# EAGLE design MOD-Z_01_V02 (EAGLE 9.6.2)
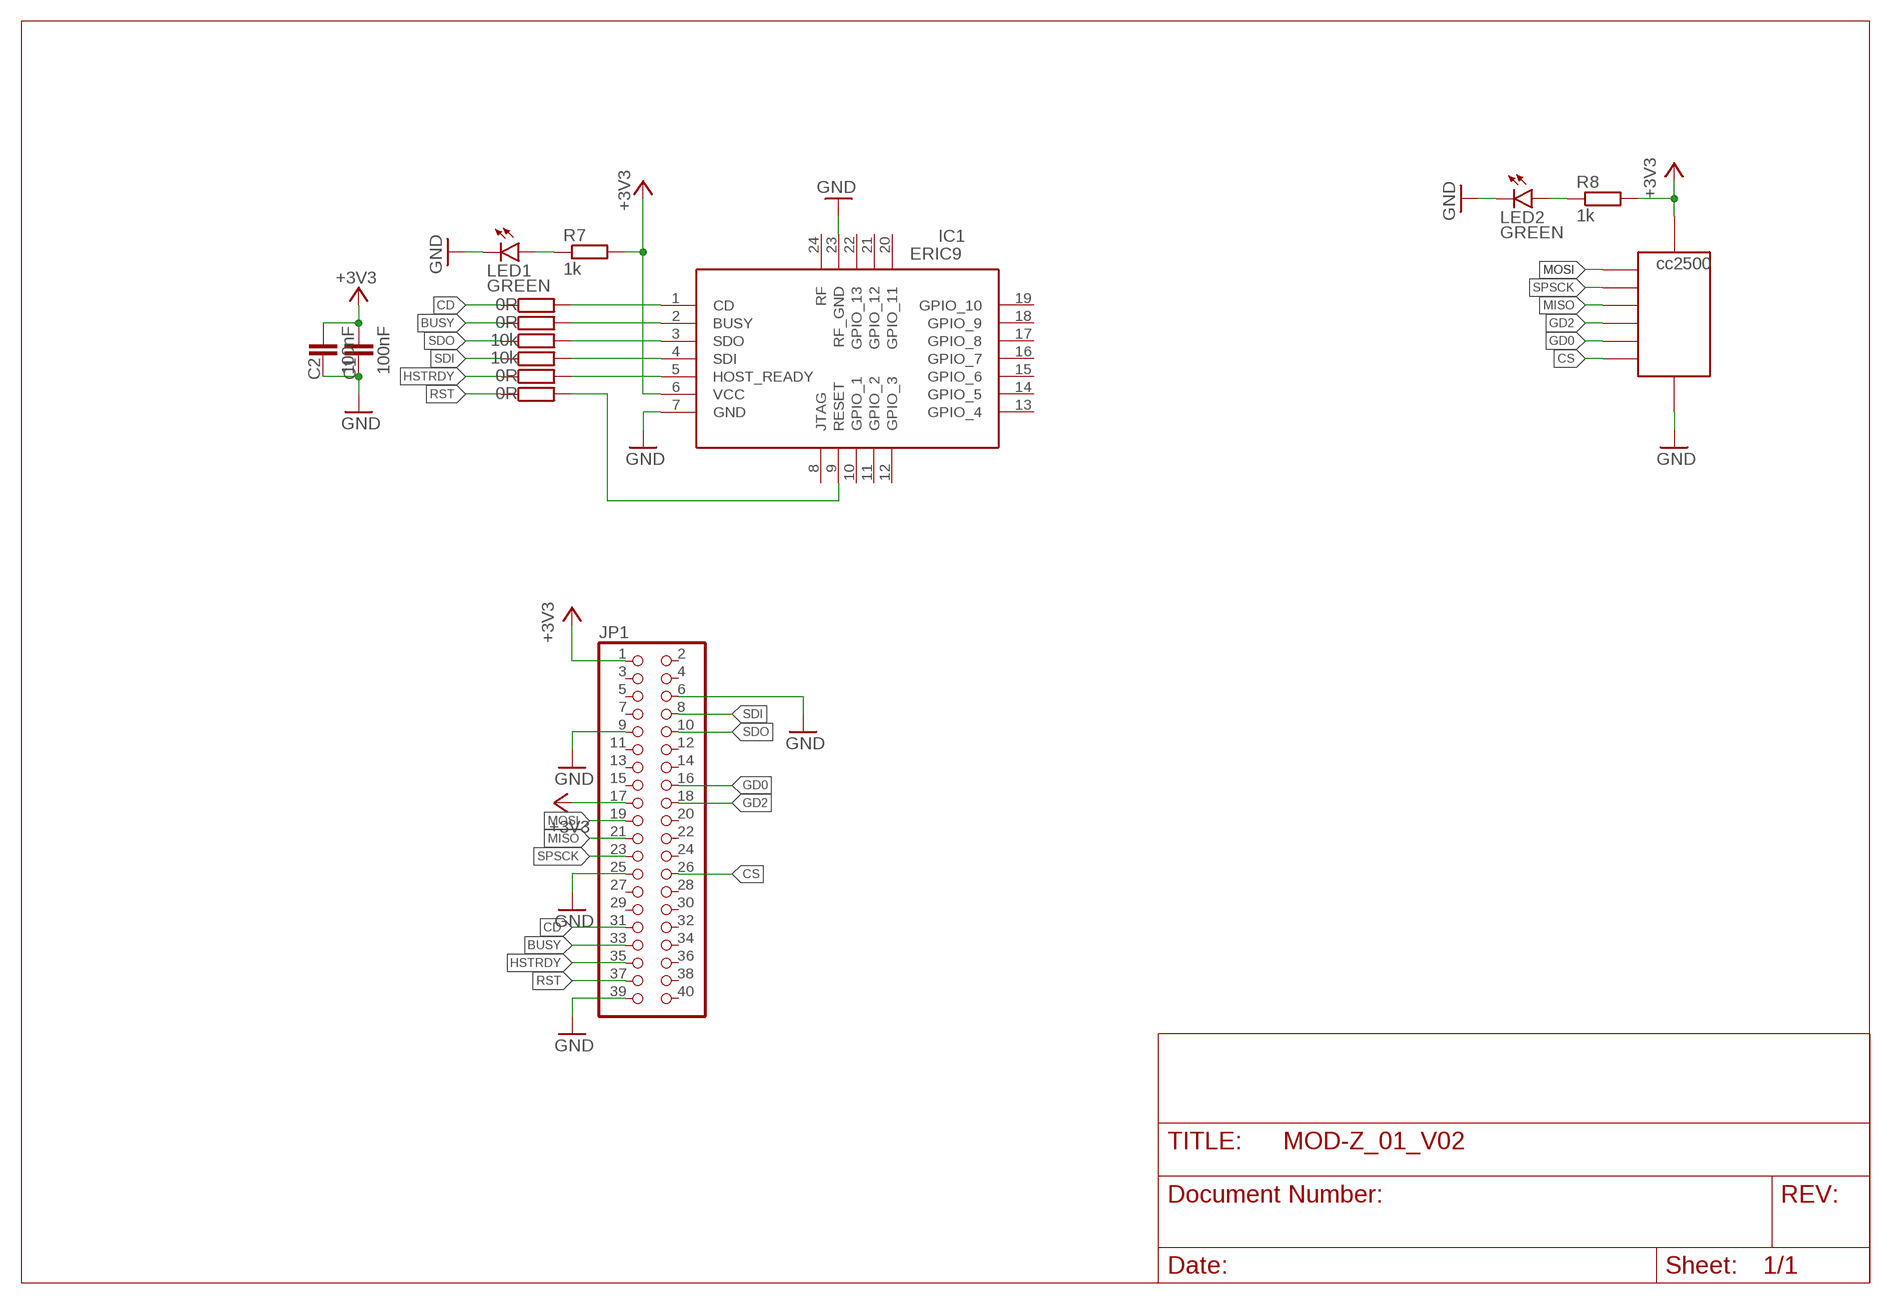
[diagram p0: schematic, sheet 1]

## Parts
C1  100nF  C-EUC0805  [C0805]
C2  100nF  C-EUC0805  [C0805]
IC1  ERIC9  [ERIC9]
IC2  CC2500  [CC2500]
JP1  PINHD-2X20  [2X20]
LED1  GREEN  LEDCHIP-LED0805  [CHIP-LED0805]
LED2  GREEN  LEDCHIP-LED0805  [CHIP-LED0805]
R1  0R  R-EU_R0805  [R0805]
R2  0R  R-EU_R0805  [R0805]
R3  10k  R-EU_R0805  [R0805]
R4  10k  R-EU_R0805  [R0805]
R5  0R  R-EU_R0805  [R0805]
R6  0R  R-EU_R0805  [R0805]
R7  1k  R-EU_R0805  [R0805]
R8  1k  R-EU_R0805  [R0805]

## Nets
+3V3: C1.1 C2.1 IC1.6(VCC) IC2.+3V3 JP1.1 JP1.17 R7.2 R8.2
BUSY: JP1.33 R2.1
CD: JP1.31 R1.1
CS: IC2.CS JP1.26
GD0: IC2.SPSCK JP1.16
GD2: IC2.MOSI JP1.18
GND: C1.2 C2.2 IC1.7(GND) IC1.23(RF_GND) IC2.GND JP1.6 JP1.9 JP1.25 JP1.39 LED1.C LED2.C
HSTRDY: JP1.35 R5.1
MISO: IC2.MISO JP1.21
MOSI: IC2.GD0 JP1.19
N$1: LED2.A R8.1
N$2: IC1.1(CD) R1.2
N$4: IC1.9(RESET) R6.2
N$5: IC1.2(BUSY) R2.2
N$6: IC1.3(SDO) R3.2
N$7: IC1.4(SDI) R4.2
N$8: IC1.5(HOST_READY) R5.2
N$19: LED1.A R7.1
RST: JP1.37 R6.1
SDI: JP1.8 R4.1
SDO: JP1.10 R3.1
SPSCK: IC2.GD2 JP1.23
Unconnected: IC1.8(JTAG) IC1.10(GPIO_1) IC1.11(GPIO_2) IC1.12(GPIO_3) IC1.13(GPIO_4) IC1.14(GPIO_5) IC1.15(GPIO_6) IC1.16(GPIO_7) IC1.17(GPIO_8) IC1.18(GPIO_9) IC1.19(GPIO_10) IC1.20(GPIO_11) IC1.21(GPIO_12) IC1.22(GPIO_13) IC1.24(RF) JP1.2 JP1.3 JP1.4 JP1.5 JP1.7 JP1.11 JP1.12 JP1.13 JP1.14 JP1.15 JP1.20 JP1.22 JP1.24 JP1.27 JP1.28 JP1.29 JP1.30 JP1.32 JP1.34 JP1.36 JP1.38 JP1.40

## Library data of the parts
C1 C2 = rcl:C-EU: CAPACITOR, European symbol; SPICEPREFIX: C
IC1 = eRIC9:ERIC9: eRIC9 Radio Transceiver !! Source: Datasheet <https://www.mouser.com/datasheet/2/743/lprs_eRIC9-FCC-1217491.pdf>; DESCRIPTION: eRIC9 Radio Transceiver !!; HEIGHT: 2mm; MANUFACTURER_NAME: LPRS; MANUFACTURER_PART_NUMBER: eRIC9
IC2 = Andreas:CC2500
JP1 = pinhead:PINHD-2X20: PIN HEADER
LED1 LED2 = led:LED: LED OSRAM: - CHIPLED LG R971, LG N971, LY N971, LG Q971, LY Q971, LO R971, LY R971 LH N974, LH R974 LS Q976, LO Q976, LY Q976 LO Q996 - Hyper CHIPLED LW Q18S LB Q993, LB Q99A, LB R99A - SideLED LS A670, LO A670, LY A670, LG A670, LP A670 LB A673, LV A673, LT A673, LW A673 LH A674 LY A675 LS A676, LA A676, LO A676, LY A676, LW A676 LS A679, LY A679, LG A679 - Hyper Micro SIDELED® LS Y876, LA Y876, LO Y876, LY Y876 LT Y87S - SmartLED LW L88C, LW L88S LB L89C, LB L89S, LG L890 LS L89K, LO L89K, LY L89K LS L896, LA L896, LO L896, LY L896 - TOPLED LS T670, LO T670, LY T670, LG T670, LP T670 LSG T670, LSP T670, LSY T670, LOP T670, LYG T670 LG T671, LOG T671, LSG T671 LB T673, LV T673, LT T673, LW T673 LH T674 LS T676, LA T676, LO T676, LY T676, LB T676, LH T676, LSB T676, LW T676 LB T67C, LV T67C, LT T67C, LS T67K, LO T67K, LY T67K, LW E67C LS E67B, LA E67B, LO E67B, LY E67B, LB E67C, LV E67C, LT E67C LW T67C LS T679, LY T679, LG T679 LS T770, LO T770, LY T770, LG T770, LP T770 LB T773, LV T773, LT T773, LW T773 LH T774 LS E675, LA E675, LY E675, LS T675 LS T776, LA T776, LO T776, LY T776, LB T776 LHGB T686 LT T68C, LB T68C - Hyper Mini TOPLED® LB M676 - Mini TOPLED Santana® LG M470 LS M47K, LO M47K, LY M47K Source: http://www.osram.convergy.de LUXEON: - LUMILED® LXK2-PW12-R00, LXK2-PW12-S00, LXK2-PW14-U00, LXK2-PW14-V00 LXK2-PM12-R00, LXK2-PM12-S00, LXK2-PM14-U00 LXK2-PE12-Q00, LXK2-PE12-R00, LXK2-PE12-S00, LXK2-PE14-T00, LXK2-PE14-U00 LXK2-PB12-K00, LXK2-PB12-L00, LXK2-PB12-M00, LXK2-PB14-N00, LXK2-PB14-P00, LXK2-PB14-Q00 LXK2-PR12-L00, LXK2-PR12-M00, LXK2-PR14-Q00, LXK2-PR14-R00 LXK2-PD12-Q00, LXK2-PD12-R00, LXK2-PD12-S00 LXK2-PH12-R00, LXK2-PH12-S00 LXK2-PL12-P00, LXK2-PL12-Q00, LXK2-PL12-R00 Source: www.luxeon.com KINGBRIGHT: KA-3528ASYC Source: www.kingbright.com
R1-R8 = rcl:R-EU_: RESISTOR, European symbol; SPICEPREFIX: R

## Board
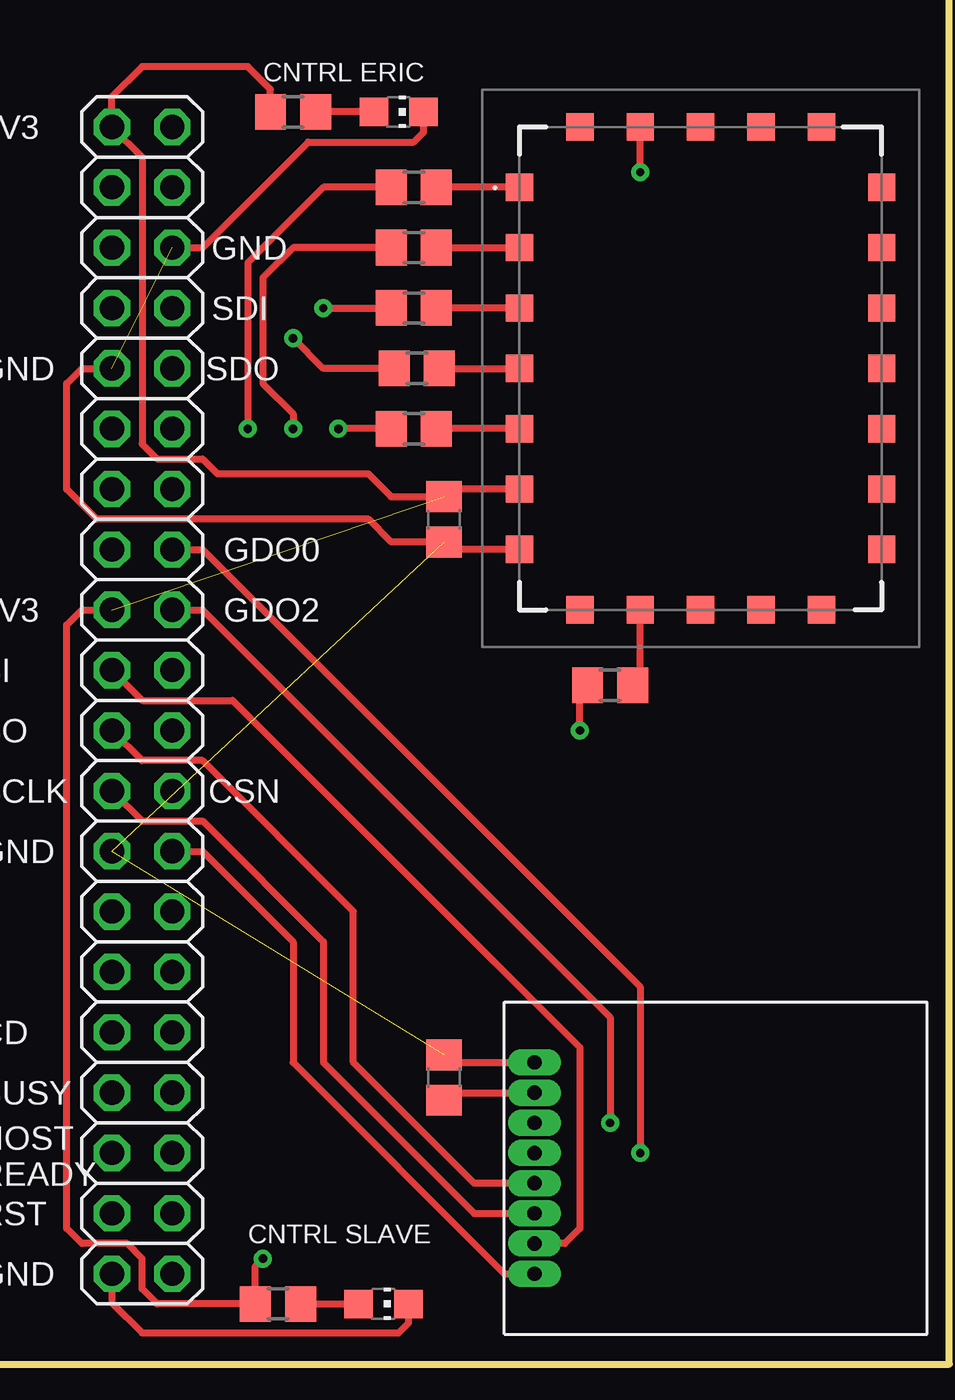
[diagram p1: board, top side]
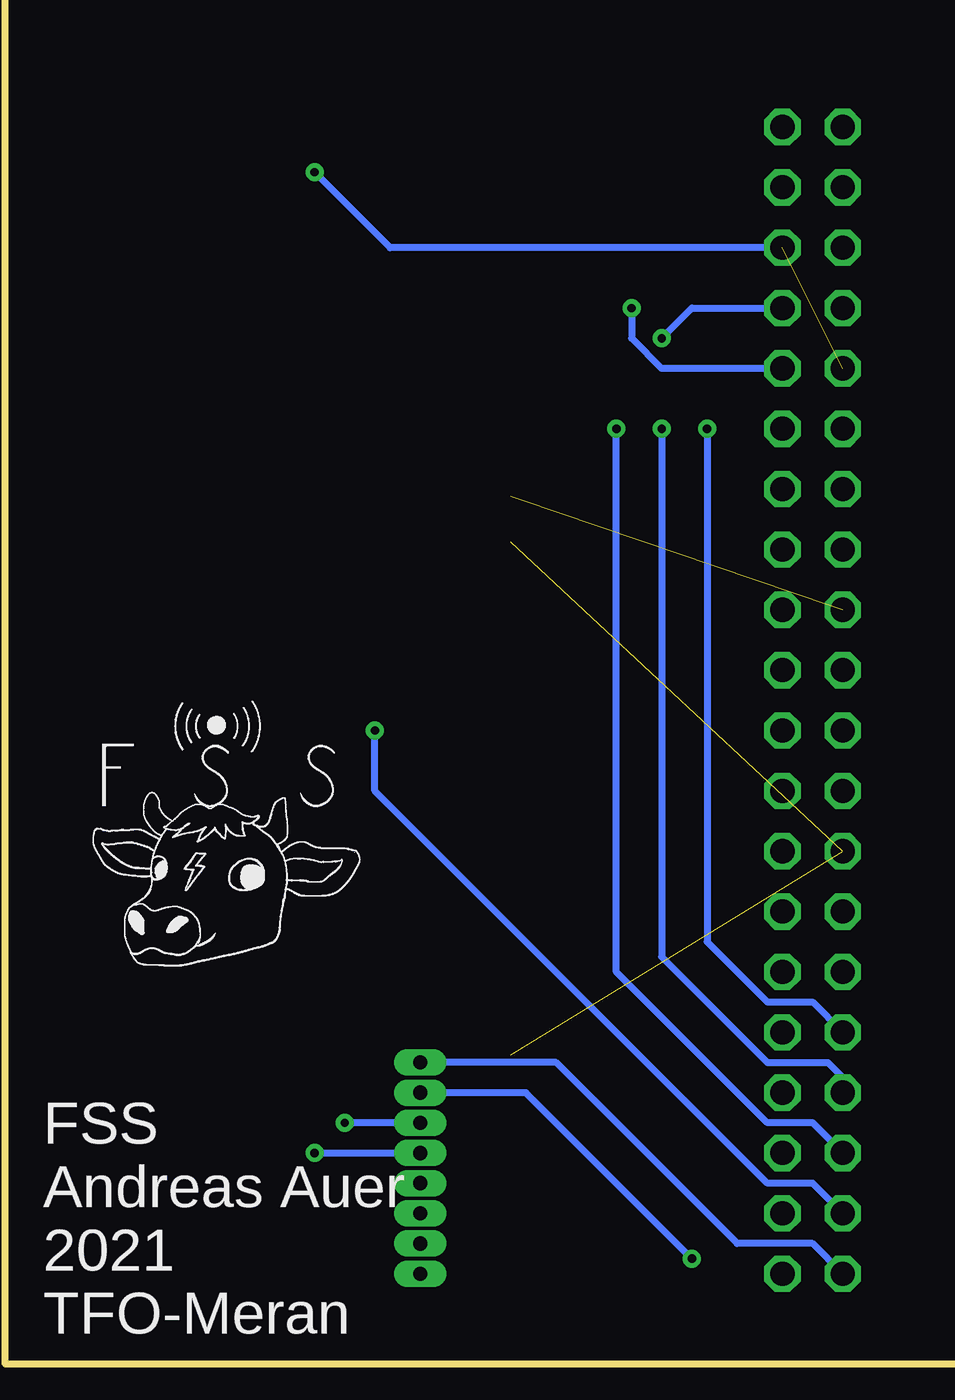
[diagram p2: board, bottom side, seen from below]

No outline drawn. Coordinates in mm, seen from the top.
Copper layers (1*16): Top 0.035mm / dielectric 1.5mm / Bottom 0.035mm
Design rules "default *": minimum track width 6mil, minimum drill 0.35mm, track to track 12mil, track to pad 12mil, pad to pad 12mil, via to via 12mil, smd to smd 12mil, copper to edge 40mil, drill to drill 12mil, minimum pad ring 10mil, minimum via ring 8mil, stop-mask expansion 4mil, vias tented up to drill 0mil, thermal gap 10mil
Milling: 4 lines

### Footprints (pad centres in the part's own frame; a part is rotated, then mirrored left to right if it is on the bottom)
C0805 = smd 1.3 x 1.5: 1 -0.95,0; 2 0.95,0
ERIC9 = smd 1.15 x 1.15: 1 -7.62,-7.62; 2 -5.08,-7.62; 3 -2.54,-7.62; 4 0,-7.62; 5 2.54,-7.62; 6 5.08,-7.62; 7 7.62,-7.62; 8 10.16,-5.08; 9 10.16,-2.54; 10 10.16,0; 11 10.16,2.54; 12 10.16,5.08; 13 7.62,7.62; 14 5.08,7.62; 15 2.54,7.62; 16 0,7.62; 17 -2.54,7.62; 18 -5.08,7.62; 19 -7.62,7.62; 20 -10.16,5.08; 21 -10.16,2.54; 22 -10.16,0; 23 -10.16,-2.54; 24 -10.16,-5.08
CC2500 = drill 0.6 pad 1.016 long: +3V3 1.27,8.89; CS 1.27,1.27; GD0 1.27,2.54; GD2 1.27,3.81; GND 1.27,10.16; MISO 1.27,5.08; MOSI 1.27,7.62; SPSCK 1.27,6.35
2X20 = drill 1.016 octagon: 1 -24.13,-1.27; 2 -24.13,1.27; 3 -21.59,-1.27; 4 -21.59,1.27; 5 -19.05,-1.27; 6 -19.05,1.27; 7 -16.51,-1.27; 8 -16.51,1.27; 9 -13.97,-1.27; 10 -13.97,1.27; 11 -11.43,-1.27; 12 -11.43,1.27; 13 -8.89,-1.27; 14 -8.89,1.27; 15 -6.35,-1.27; 16 -6.35,1.27; 17 -3.81,-1.27; 18 -3.81,1.27; 19 -1.27,-1.27; 20 -1.27,1.27; 21 1.27,-1.27; 22 1.27,1.27; 23 3.81,-1.27; 24 3.81,1.27; 25 6.35,-1.27; 26 6.35,1.27; 27 8.89,-1.27; 28 8.89,1.27; 29 11.43,-1.27; 30 11.43,1.27; 31 13.97,-1.27; 32 13.97,1.27; 33 16.51,-1.27; 34 16.51,1.27; 35 19.05,-1.27; 36 19.05,1.27; 37 21.59,-1.27; 38 21.59,1.27; 39 24.13,-1.27; 40 24.13,1.27
CHIP-LED0805 = smd 1.2 x 1.2: A 0,-1.05; C 0,1.05
R0805 = smd 1.3 x 1.5: 1 -0.95,0; 2 0.95,0

### Placement (x,y rotation side)
C1  18.41,35.56 270 top
C2  18.41,12.06 90 top
IC1  29.21,41.91 270 top
IC2  20.95,2.54 0 top
JP1  5.71,27.94 270 top
LED1  16.51,52.7 270 top
LED2  15.88,2.54 270 top
R1  17.14,49.53 0 top
R2  17.14,46.99 0 top
R3  17.14,44.45 0 top
R4  17.27,41.91 0 top
R5  17.14,39.37 0 top
R6  25.4,28.57 0 top
R7  12.06,52.7 180 top
R8  11.43,2.54 180 top

### Tracks (layer width: path | path; a pad name or v marks a point on that pad's centre or on a via)
+3V3  (via drill 0.35)  (1 unrouted)
  Top 0.305: IC1.6 18.73,36.83 C1.1 16.2,36.51 15.24,37.47 8.89,37.47 8.26,38.1 6.35,38.1 5.71,38.73 5.71,50.8 JP1.1 4.45,53.34 5.71,54.61 10.16,54.61 11.12,53.66 R7.2 | IC2.+3V3 18.73,11.43 C2.1 18.09,10.79 | JP1.17 3.17,31.75 2.54,31.11 2.54,5.71 3.17,5.08 5.08,5.08 5.71,4.45 5.71,3.17 6.35,2.54 R8.2 10.48,4.13 v10.79,4.45
  Bottom 0.305: v10.79,4.45 17.78,11.43 IC2.+3V3
BUSY  (via drill 0.35)
  Top 0.305: R2.1 12.06,46.99 10.79,45.72 10.79,41.27 12.06,40.01 v12.06,39.37
  Bottom 0.305: v12.06,39.37 12.06,17.14 7.62,12.7 5.08,12.7 4.45,12.06 JP1.33
CD  (via drill 0.35)
  Top 0.305: R1.1 13.34,49.53 10.16,46.35 v10.16,39.37
  Bottom 0.305: JP1.31 5.71,15.24 7.62,15.24 10.16,17.78 v10.16,39.37
CS
  Top 0.305: JP1.26 8.26,21.59 12.06,17.78 12.06,12.7 20.95,3.81 IC2.CS
GD0  (via drill 0.35)
  Top 0.305: JP1.16 8.26,34.29 26.67,15.88 v26.67,8.89
  Bottom 0.305: v26.67,8.89 IC2.SPSCK
GD2  (via drill 0.35)
  Top 0.305: JP1.18 8.26,31.75 25.4,14.61 v25.4,10.16
  Bottom 0.305: IC2.MOSI v25.4,10.16
GND  (via drill 0.35)  (3 unrouted)
  Top 0.305: IC1.7 18.73,34.29 C1.2 16.19,34.61 15.24,35.56 3.81,35.56 2.54,36.83 2.54,41.27 3.17,41.91 JP1.9 | v26.67,50.16 IC1.23 | JP1.6 8.26,46.99 12.7,51.44 17.14,51.44 17.56,51.85 LED1.C | C2.2 18.73,12.7 IC2.GND | JP1.39 4.45,2.59 5.71,1.32 16.51,1.32 16.93,1.74 LED2.C
  Bottom 0.305: JP1.6 23.5,46.99 v26.67,50.16 | JP1.39 5.71,5.08 8.89,5.08 16.51,12.7 IC2.GND
HSTRDY  (via drill 0.35)
  Top 0.305: R5.1 v13.97,39.37
  Bottom 0.305: JP1.35 5.71,10.16 7.62,10.16 13.97,16.51 v13.97,39.37
MISO
  Top 0.305: JP1.21 5.71,25.4 8.26,25.4 14.61,19.05 14.61,12.7 19.68,7.62 IC2.MISO
MOSI
  Top 0.305: JP1.19 5.71,27.94 9.53,27.94 24.13,13.34 24.13,5.71 23.5,5.08 IC2.GD0
N$1
  Top 0.305: R8.1 LED2.A
N$2
  Top 0.305: IC1.1 R1.2
N$4
  Top 0.305: R6.2 26.67,28.89 IC1.9
N$5
  Top 0.305: R2.2 IC1.2
N$6
  Top 0.305: IC1.3 R3.2
N$7
  Top 0.305: R4.2 IC1.4
N$8
  Top 0.305: IC1.5 R5.2
N$19
  Top 0.305: LED1.A R7.1
RST  (via drill 0.35)
  Top 0.305: v24.13,26.67 24.13,28.25 R6.1
  Bottom 0.305: v24.13,26.67 24.13,24.13 7.62,7.62 5.71,7.62 JP1.37
SDI  (via drill 0.35)
  Top 0.305: R4.1 13.34,41.91 v12.06,43.18
  Bottom 0.305: v12.06,43.18 10.79,44.45 JP1.8
SDO  (via drill 0.35)
  Top 0.305: v13.34,44.45 R3.1
  Bottom 0.305: JP1.10 12.06,41.91 13.34,43.18 v13.34,44.45
SPSCK
  Top 0.305: JP1.23 5.71,22.86 8.26,22.86 13.34,17.78 13.34,12.7 19.68,6.35 IC2.GD2

### Text on the board
tPlace: CNTRL ERIC | 3V3 | GND | SDI | GND | SDO | GDO0 | 3V3 | GDO2 | SI | SO | SCLK | CSN | GND | CD | BUSY | HOST / READY | RST | CNTRL SLAVE | GND
bPlace: FSS / Andreas Auer / 2021 / TFO-Meran | C:/Users/Kneidl/OneDrive - Bildungsdirektion/Andreas/Oberschule/5. Oberschule 202122/Maturaprjoct/drawing/Logo/FSSLOGOCut_BW.bmp